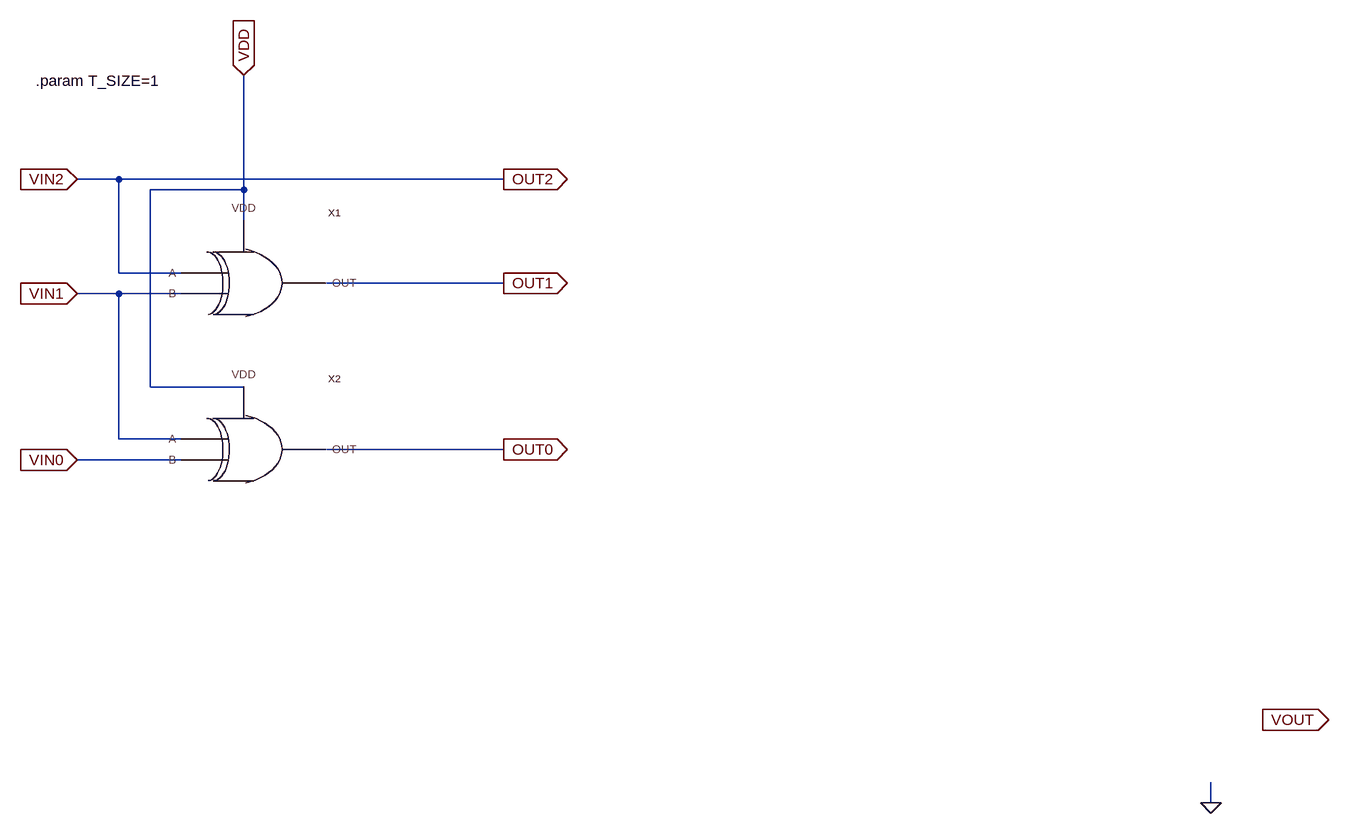
[diagram p0: schematic gray.asc]
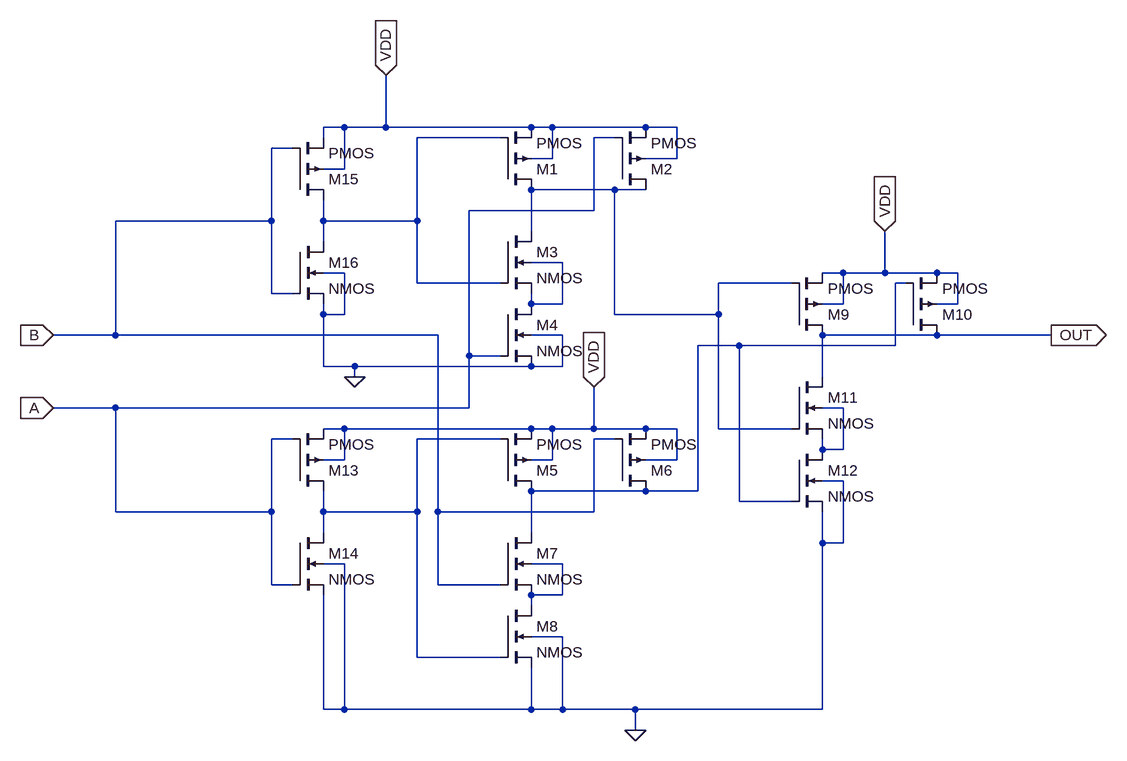
[diagram p1: sub-circuit xor.asc]
gray.asc, the LTspice schematic file:
Version 4
SHEET 1 880 852
WIRE -1024 -128 -1088 -128
WIRE -432 -128 -1024 -128
WIRE -832 -112 -832 -288
WIRE -832 -112 -976 -112
WIRE -832 -64 -832 -112
WIRE -1024 16 -1024 -128
WIRE -928 16 -1024 16
WIRE -432 32 -704 32
WIRE -1024 48 -1088 48
WIRE -928 48 -1024 48
WIRE -976 192 -976 -112
WIRE -832 192 -976 192
WIRE -1024 272 -1024 48
WIRE -928 272 -1024 272
WIRE -432 288 -704 288
WIRE -928 304 -1088 304
WIRE 656 832 656 800
FLAG -1088 -128 VIN2
IOPIN -1088 -128 In
FLAG -832 -288 VDD
IOPIN -832 -288 In
FLAG 736 704 VOUT
IOPIN 736 704 Out
FLAG 656 832 0
FLAG -1088 48 VIN1
IOPIN -1088 48 In
FLAG -1088 304 VIN0
IOPIN -1088 304 In
FLAG -432 -128 OUT2
IOPIN -432 -128 Out
FLAG -432 32 OUT1
IOPIN -432 32 Out
FLAG -432 288 OUT0
IOPIN -432 288 Out
SYMBOL xor -832 32 R0
SYMATTR InstName X1
SYMBOL xor -832 288 R0
SYMATTR InstName X2
TEXT -1152 -280 Left 2 !.param T_SIZE=1

xor.asc, the sub-circuit schematic file:
Version 4
SHEET 1 880 852
WIRE -688 -96 -720 -96
WIRE -624 -96 -624 -176
WIRE -624 -96 -688 -96
WIRE -400 -96 -624 -96
WIRE -368 -96 -400 -96
WIRE -224 -96 -368 -96
WIRE -176 -96 -224 -96
WIRE -720 -80 -720 -96
WIRE -448 -80 -576 -80
WIRE -272 -80 -304 -80
WIRE -768 -64 -800 -64
WIRE -368 -48 -368 -96
WIRE -368 -48 -400 -48
WIRE -176 -48 -176 -96
WIRE -176 -48 -224 -48
WIRE -688 -32 -688 -96
WIRE -688 -32 -720 -32
WIRE -272 0 -400 0
WIRE -224 0 -272 0
WIRE -304 32 -304 -80
WIRE -304 32 -496 32
WIRE -800 48 -800 -64
WIRE -800 48 -1040 48
WIRE -720 48 -720 16
WIRE -576 48 -576 -80
WIRE -576 48 -720 48
WIRE -400 64 -400 0
WIRE -720 80 -720 48
WIRE -352 112 -400 112
WIRE -688 128 -720 128
WIRE 80 128 48 128
WIRE 144 128 144 64
WIRE 144 128 80 128
WIRE 224 128 144 128
WIRE 256 128 224 128
WIRE -576 144 -576 48
WIRE -448 144 -576 144
WIRE 0 144 -112 144
WIRE 176 144 160 144
WIRE -800 160 -800 48
WIRE -768 160 -800 160
WIRE -400 176 -400 160
WIRE -352 176 -352 112
WIRE -352 176 -400 176
WIRE 80 176 80 128
WIRE 80 176 48 176
WIRE 256 176 256 128
WIRE 256 176 224 176
WIRE -720 192 -720 176
WIRE -688 192 -688 128
WIRE -688 192 -720 192
WIRE -272 192 -272 0
WIRE -112 192 -112 144
WIRE -112 192 -272 192
WIRE -1040 224 -1040 48
WIRE -1040 224 -1136 224
WIRE -544 224 -1040 224
WIRE -352 224 -400 224
WIRE 224 224 48 224
WIRE 400 224 224 224
WIRE -80 240 -144 240
WIRE 160 240 160 144
WIRE 160 240 -80 240
WIRE -496 256 -496 32
WIRE -448 256 -496 256
WIRE -720 272 -720 192
WIRE -672 272 -720 272
WIRE -400 272 -672 272
WIRE -352 272 -352 224
WIRE -352 272 -400 272
WIRE -672 288 -672 272
WIRE 48 288 48 224
WIRE -1040 336 -1136 336
WIRE -496 336 -496 256
WIRE -496 336 -1040 336
WIRE 80 336 48 336
WIRE -688 368 -720 368
WIRE -400 368 -688 368
WIRE -368 368 -400 368
WIRE -304 368 -304 304
WIRE -304 368 -368 368
WIRE -224 368 -304 368
WIRE -176 368 -224 368
WIRE -112 368 -112 192
WIRE 0 368 -112 368
WIRE -768 384 -800 384
WIRE -448 384 -576 384
WIRE -272 384 -304 384
WIRE 48 400 48 384
WIRE 80 400 80 336
WIRE 80 400 48 400
WIRE -688 416 -688 368
WIRE -688 416 -720 416
WIRE -368 416 -368 368
WIRE -368 416 -400 416
WIRE -176 416 -176 368
WIRE -176 416 -224 416
WIRE 80 448 48 448
WIRE -224 464 -400 464
WIRE -144 464 -144 240
WIRE -144 464 -224 464
WIRE -80 480 -80 240
WIRE 0 480 -80 480
WIRE -1040 496 -1040 336
WIRE -800 496 -800 384
WIRE -800 496 -1040 496
WIRE -720 496 -720 464
WIRE -576 496 -576 384
WIRE -576 496 -720 496
WIRE -544 496 -544 224
WIRE -304 496 -304 384
WIRE -304 496 -544 496
WIRE -720 528 -720 496
WIRE -400 528 -400 464
WIRE 48 544 48 496
WIRE 80 544 80 448
WIRE 80 544 48 544
WIRE -688 576 -720 576
WIRE -352 576 -400 576
WIRE -800 608 -800 496
WIRE -768 608 -800 608
WIRE -544 608 -544 496
WIRE -448 608 -544 608
WIRE -352 624 -352 576
WIRE -352 624 -400 624
WIRE -400 640 -400 624
WIRE -352 688 -400 688
WIRE -576 720 -576 496
WIRE -448 720 -576 720
WIRE -720 800 -720 624
WIRE -688 800 -688 576
WIRE -688 800 -720 800
WIRE -400 800 -400 736
WIRE -400 800 -688 800
WIRE -352 800 -352 688
WIRE -352 800 -400 800
WIRE -240 800 -352 800
WIRE 48 800 48 544
WIRE 48 800 -240 800
WIRE -240 832 -240 800
FLAG -1136 336 A
IOPIN -1136 336 In
FLAG -1136 224 B
IOPIN -1136 224 In
FLAG 400 224 OUT
IOPIN 400 224 Out
FLAG -624 -176 VDD
IOPIN -624 -176 In
FLAG -304 304 VDD
IOPIN -304 304 In
FLAG 144 64 VDD
IOPIN 144 64 In
FLAG -672 288 0
FLAG -240 832 0
SYMBOL pmos4 -448 0 M180
SYMATTR InstName M1
SYMBOL pmos4 -272 0 M180
SYMATTR InstName M2
SYMBOL nmos4 -448 64 R0
SYMATTR InstName M3
SYMBOL nmos4 -448 176 R0
SYMATTR InstName M4
SYMBOL pmos4 -448 464 M180
SYMATTR InstName M5
SYMBOL pmos4 -272 464 M180
SYMATTR InstName M6
SYMBOL nmos4 -448 528 R0
SYMATTR InstName M7
SYMBOL nmos4 -448 640 R0
SYMATTR InstName M8
SYMBOL pmos4 0 224 M180
SYMATTR InstName M9
SYMBOL pmos4 176 224 M180
SYMATTR InstName M10
SYMBOL nmos4 0 288 R0
SYMATTR InstName M11
SYMBOL nmos4 0 400 R0
SYMATTR InstName M12
SYMBOL pmos4 -768 464 M180
SYMATTR InstName M13
SYMBOL nmos4 -768 528 R0
SYMATTR InstName M14
SYMBOL pmos4 -768 16 M180
SYMATTR InstName M15
SYMBOL nmos4 -768 80 R0
SYMATTR InstName M16

The netlist it stands for:
* gray.asc
XX1 OUT2 VIN1 OUT1 VDD xor
XX2 VIN1 VIN0 OUT0 VDD xor

* block symbol definitions
.subckt xor A B OUT VDD
M1 N002 N001 VDD VDD PMOS
M2 N002 A VDD VDD PMOS
M3 N002 N001 N003 N003 NMOS
M4 N003 A 0 0 NMOS
M5 N004 N006 VDD VDD PMOS
M6 N004 B VDD VDD PMOS
M7 N004 B N007 N007 NMOS
M8 N007 N006 0 0 NMOS
M9 OUT N002 VDD VDD PMOS
M10 OUT N004 VDD VDD PMOS
M11 OUT N002 N005 N005 NMOS
M12 N005 N004 0 0 NMOS
M13 N006 A VDD VDD PMOS
M14 N006 A 0 0 NMOS
M15 N001 B VDD VDD PMOS
M16 N001 B 0 0 NMOS
.ends xor

.model NMOS NMOS
.model PMOS PMOS
.lib standard.mos
.param T_SIZE=1
.backanno
.end